# Altium project UZ_CarrierBoard.PrjPcb (part 3 of 10)

## Sheet Analog_Interface.SchDoc
size A4; Author: AG / EA / MG; CompanyName: Technische Hochschule Nürnberg Georg Simon Ohm; Organization: UltraZohm; Address1: Kesslerplatz 12; Address2: 90489 Nürnberg; Address3: GERMANY; SheetNumber: 17; Website: www.ultrazohm.com
Used 3 times, as channels U_Signal_Distribution/ANL1, U_Signal_Distribution/ANL2, U_Signal_Distribution/ANL3. Parts and nets are listed once, with the designators drawn on the sheet.
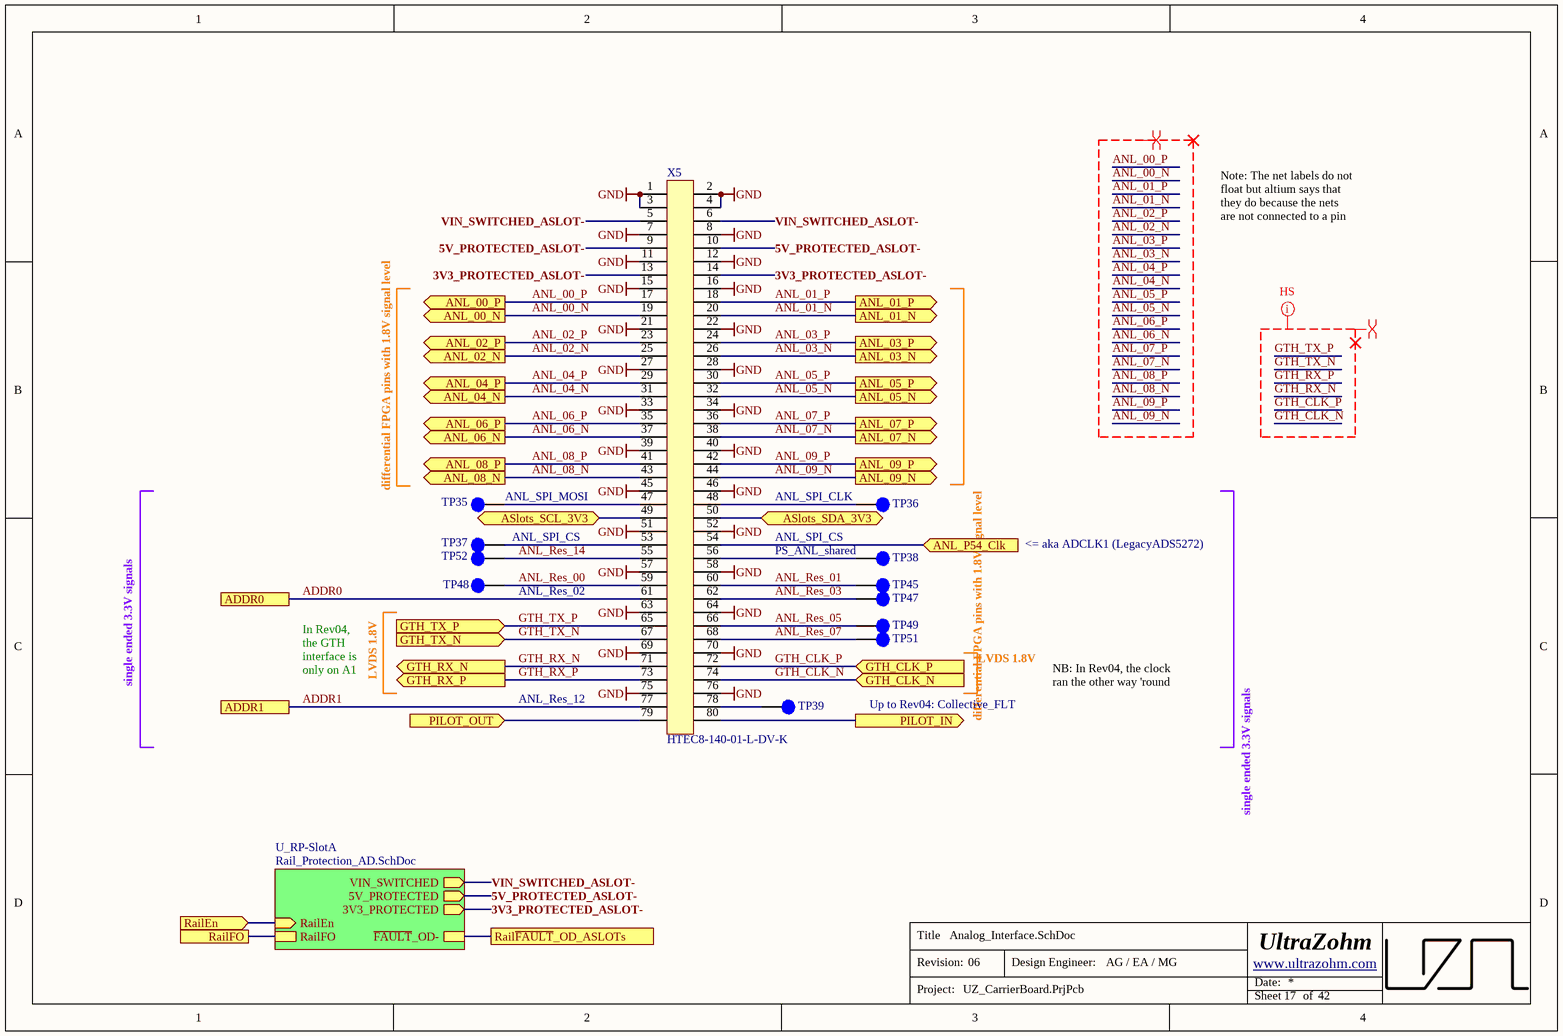
[diagram p4: Analog_Interface.SchDoc]

### Parts
TP35  Testpoint 1mm  [TP_1mm]  (value not drawn)  (no BOM)
TP36  Testpoint 1mm  [TP_1mm]  (value not drawn)  (no BOM)
TP37  Testpoint 1mm  [TP_1mm]  (value not drawn)  (no BOM)
TP38  Testpoint 1mm  [TP_1mm]  (value not drawn)  (no BOM)
TP39  Testpoint 1mm  [TP_1mm]  (value not drawn)  (no BOM)
TP45  Testpoint 1mm  [TP_1mm]  (value not drawn)  (no BOM)
TP47  Testpoint 1mm  [TP_1mm]  (value not drawn)  (no BOM)
TP48  Testpoint 1mm  [TP_1mm]  (value not drawn)  (no BOM)
TP49  Testpoint 1mm  [TP_1mm]  (value not drawn)  (no BOM)
TP51  Testpoint 1mm  [TP_1mm]  (value not drawn)  (no BOM)
TP52  Testpoint 1mm  [TP_1mm]  (value not drawn)  (no BOM)
X5  HTEC8-140-01-L-DV-K  [HTEC8-140-XX-X-DV]

### Sub-sheets
U_RP-SlotA = Rail_Protection_AD.SchDoc: RailEn (in), VIN_SWITCHED (out), ~{FAULT}_OD-, 5V_PROTECTED (out), 3V3_PROTECTED (out), RailFO

### Ports
ADDR0, ADDR1, ANL_00_N (out), ANL_00_P (out), ANL_01_N (out), ANL_01_P (out), ANL_02_N (out), ANL_02_P (out), ANL_03_N (out), ANL_03_P (out), ANL_04_N (out), ANL_04_P (out), ANL_05_N (out), ANL_05_P (out), ANL_06_N (out), ANL_06_P (out), ANL_07_N (out), ANL_07_P (out), ANL_08_N (out), ANL_08_P (out), ANL_09_N (out), ANL_09_P (out), ANL_P54_Clk (in), ASlots_SCL_3V3 (bidir), ASlots_SDA_3V3 (bidir), GTH_CLK_N (in), GTH_CLK_P (in), GTH_RX_N (out), GTH_RX_P (out), GTH_TX_N (in), GTH_TX_P (in), PILOT_IN (out), PILOT_OUT (in), RailEn (in), RailFO, Rail~{FAULT}_OD_ASLOTs

### Nets
GND: X5.1 X5.2 X5.3 X5.4 X5.7 X5.8 X5.11 X5.12 X5.15 X5.16 X5.21 X5.22 X5.27 X5.28 X5.33 X5.34 X5.39 X5.40 X5.45 X5.46 X5.51 X5.52 X5.57 X5.58 X5.63 X5.64 X5.69 X5.70 X5.75 X5.76
3V3_PROTECTED_ASLOT-: X5.13 X5.14 ; sheet U_RP-SlotA/3V3_PROTECTED
5V_PROTECTED_ASLOT-: X5.9 X5.10 ; sheet U_RP-SlotA/5V_PROTECTED
ADDR0: X5.61 ; port ADDR0
ADDR1: X5.77 ; port ADDR1
ANL_00_N: X5.19 ; port ANL_00_N
ANL_00_P: X5.17 ; port ANL_00_P
ANL_01_N: X5.20 ; port ANL_01_N
ANL_01_P: X5.18 ; port ANL_01_P
ANL_02_N: X5.25 ; port ANL_02_N
ANL_02_P: X5.23 ; port ANL_02_P
ANL_03_N: X5.26 ; port ANL_03_N
ANL_03_P: X5.24 ; port ANL_03_P
ANL_04_N: X5.31 ; port ANL_04_N
ANL_04_P: X5.29 ; port ANL_04_P
ANL_05_N: X5.32 ; port ANL_05_N
ANL_05_P: X5.30 ; port ANL_05_P
ANL_06_N: X5.37 ; port ANL_06_N
ANL_06_P: X5.35 ; port ANL_06_P
ANL_07_N: X5.38 ; port ANL_07_N
ANL_07_P: X5.36 ; port ANL_07_P
ANL_08_N: X5.43 ; port ANL_08_N
ANL_08_P: X5.41 ; port ANL_08_P
ANL_09_N: X5.44 ; port ANL_09_N
ANL_09_P: X5.42 ; port ANL_09_P
ANL_P54_Clk: X5.54 ; port ANL_P54_Clk
ANL_Res_00: TP48.1 X5.59
ANL_Res_01: TP45.1 X5.60
ANL_Res_03: TP47.1 X5.62
ANL_Res_05: TP49.1 X5.66
ANL_Res_07: TP51.1 X5.68
ANL_Res_14: TP52.1 X5.55
ASlots_SCL_3V3: X5.49 ; port ASlots_SCL_3V3
ASlots_SDA_3V3: X5.50 ; port ASlots_SDA_3V3
GTH_CLK_N: X5.74 ; port GTH_CLK_N
GTH_CLK_P: X5.72 ; port GTH_CLK_P
GTH_RX_N: X5.71 ; port GTH_RX_N
GTH_RX_P: X5.73 ; port GTH_RX_P
GTH_TX_N: X5.67 ; port GTH_TX_N
GTH_TX_P: X5.65 ; port GTH_TX_P
PILOT_IN: X5.80 ; port PILOT_IN
PILOT_OUT: X5.79 ; port PILOT_OUT
RailEn: port RailEn, sheet U_RP-SlotA/RailEn
Rail~{FAULT}_OD_ASLOTs: port Rail~{FAULT}_OD_ASLOTs, sheet U_RP-SlotA/~{FAULT}_OD-
RailFO: port RailFO, sheet U_RP-SlotA/RailFO
VIN_SWITCHED_ASLOT-: X5.5 X5.6 ; sheet U_RP-SlotA/VIN_SWITCHED
NetTP35_1: TP35.1 X5.47
NetTP36_1: TP36.1 X5.48
NetTP37_1: TP37.1 X5.53
NetTP38_1: TP38.1 X5.56
NetTP39_1: TP39.1 X5.78

### Channels
U_Signal_Distribution/ANL1: designators end in A; ports ADDR0=ADDR0 ADDR1=ADDR1 ANL_00_N=ANL_00_N ANL_00_P=ANL_00_P ANL_01_N=ANL_01_N ANL_01_P=ANL_01_P ANL_02_N=ANL_02_N ANL_02_P=ANL_02_P ANL_03_N=ANL_03_N ANL_03_P=ANL_03_P ANL_04_N=ANL_04_N ANL_04_P=ANL_04_P ANL_05_N=ANL_05_N ANL_05_P=ANL_05_P ANL_06_N=ANL_06_N ANL_06_P=ANL_06_P ANL_07_N=ANL_07_N ANL_07_P=ANL_07_P ANL_08_N=ANL_08_N ANL_08_P=ANL_08_P ANL_09_N=ANL_09_N ANL_09_P=ANL_09_P ANL_P54_Clk=ANL_P54_Clk1 ASlots_SCL_3V3=ASlots_SCL_3V3 ASlots_SDA_3V3=ASlots_SDA_3V3 GTH_CLK_N=GTH_CLK_N GTH_CLK_P=GTH_CLK_P GTH_RX_N=GTH_RX_N GTH_RX_P=GTH_RX_P GTH_TX_N=GTH_TX_N GTH_TX_P=GTH_TX_P PILOT_IN=ANL_S3C.SlotOK1 PILOT_OUT=ANL_S3C.CarrierReady RailEn=RailEn RailFO=RailFO_A1 Rail~{FAULT}_OD_ASLOTs=~{FAULT}_OD-
U_Signal_Distribution/ANL2: designators end in B; ports ADDR0=ADDR0_ANL2 ADDR1=ADDR1 ANL_00_N=ANL_00_N ANL_00_P=ANL_00_P ANL_01_N=ANL_01_N ANL_01_P=ANL_01_P ANL_02_N=ANL_02_N ANL_02_P=ANL_02_P ANL_03_N=ANL_03_N ANL_03_P=ANL_03_P ANL_04_N=ANL_04_N ANL_04_P=ANL_04_P ANL_05_N=ANL_05_N ANL_05_P=ANL_05_P ANL_06_N=ANL_06_N ANL_06_P=ANL_06_P ANL_07_N=ANL_07_N ANL_07_P=ANL_07_P ANL_08_N=ANL_08_N ANL_08_P=ANL_08_P ANL_09_N=ANL_09_N ANL_09_P=ANL_09_P ANL_P54_Clk=ANL_P54_Clk2 ASlots_SCL_3V3=ASlots_SCL_3V3 ASlots_SDA_3V3=ASlots_SDA_3V3 GTH_CLK_N=GTH_CLK_N GTH_CLK_P=GTH_CLK_P GTH_RX_N=GTH_RX_N GTH_RX_P=GTH_RX_P GTH_TX_N=GTH_TX_N GTH_TX_P=GTH_TX_P PILOT_IN=ANL_S3C.SlotOK2 PILOT_OUT=ANL_S3C.CarrierReady RailEn=RailEn RailFO=RailFO_A2 Rail~{FAULT}_OD_ASLOTs=~{FAULT}_OD-
U_Signal_Distribution/ANL3: designators end in C; ports ADDR0=ADDR0 ADDR1=ADDR1_ANL3 ANL_00_N=ANL_00_N ANL_00_P=ANL_00_P ANL_01_N=ANL_01_N ANL_01_P=ANL_01_P ANL_02_N=ANL_02_N ANL_02_P=ANL_02_P ANL_03_N=ANL_03_N ANL_03_P=ANL_03_P ANL_04_N=ANL_04_N ANL_04_P=ANL_04_P ANL_05_N=ANL_05_N ANL_05_P=ANL_05_P ANL_06_N=ANL_06_N ANL_06_P=ANL_06_P ANL_07_N=ANL_07_N ANL_07_P=ANL_07_P ANL_08_N=ANL_08_N ANL_08_P=ANL_08_P ANL_09_N=ANL_09_N ANL_09_P=ANL_09_P ANL_P54_Clk=ANL_P54_Clk3 ASlots_SCL_3V3=ASlots_SCL_3V3 ASlots_SDA_3V3=ASlots_SDA_3V3 GTH_CLK_N=GTH_CLK_N GTH_CLK_P=GTH_CLK_P GTH_RX_N=GTH_RX_N GTH_RX_P=GTH_RX_P GTH_TX_N=GTH_TX_N GTH_TX_P=GTH_TX_P PILOT_IN=ANL_S3C.SlotOK3 PILOT_OUT=ANL_S3C.CarrierReady RailEn=RailEn RailFO=RailFO_A3 Rail~{FAULT}_OD_ASLOTs=~{FAULT}_OD-

### Layout directives
differential pair: ANL_00_N, ANL_00_P, ANL_01_N, ANL_01_P, ANL_02_N, ANL_02_P, ANL_03_N, ANL_03_P, ANL_04_N, ANL_04_P, ANL_05_N, ANL_05_P, ANL_06_N, ANL_06_P, ANL_07_N, ANL_07_P, ANL_08_N, ANL_08_P, ANL_09_N, ANL_09_P, GTH_CLK_N, GTH_CLK_P, GTH_RX_N, GTH_RX_P, GTH_TX_N, GTH_TX_P
net class HS: GTH_CLK_N, GTH_CLK_P, GTH_RX_N, GTH_RX_P, GTH_TX_N, GTH_TX_P

### Notes on the sheet
- Note: The net labels do not float but altium says that they do because the nets are not connected to a pin
- differential FPGA pins with 1.8V signal level
- (near TP35) ANL_SPI_MOSI
- (near TP36) ANL_SPI_CLK
- ANL_SPI_CS
- PS_ANL_shared
- <= aka ADCLK1 (LegacyADS5272)
- ANL_Res_02
- single ended 3.3V signals
- In Rev04, the GTH interface is only on A1
- LVDS 1.8V
- ANL_Res_12
- Up to Rev04: Collective_FLT
- NB: In Rev04, the clock ran the other way 'round
- Title
- Revision:
- Design Engineer:
- Date:
- Project:
- Sheet
- of

### Library data of the parts
TP35-TP39 = NULL: Manufacturer Part Number: NULL; Created from: AGeiger; Created: 2018_06_25_AGeiger; Value: Testpoint 1mm; PartID: 9; Created On: 20/09/2022 13:14:57; Component Type: Testpoint; Last Updated: 20/09/2022 13:15:39; Manufacturer: NULL; Supplier 1: NULL; Supplier Part Number 1: NULL; Type: Testpoint; Live Cycle Status: 1
TP45 TP47-TP49 TP51 TP52 = 25063: AN: 25063; Mixed: SMT
X5 = HTEC8-140-01-L-DV-K: Headers & Wire Housings 0.80 mm Rugged High-Speed Edge Card Connectors; Manufacturer: SAMTEC; Created from: AGeiger; Number of positions: 80; Manufacturer Part Number: HTEC8-140-01-L-DV-K; PartID: 23; Created On: 07/06/2024 14:27:34; ComponentLink1Description: Datasheet; ComponentLink1URL: https://suddendocs.samtec.com/catalog_english/htec8.pdf; Component Type: Board to Board Connector; Device Package: SMD; Last Updated: 09/07/2024 10:19:13; Mounting Type: SMD; Series: HTEC8; Supplier 1: SAMTEC; Supplier Part Number 1: HTEC8-140-01-L-DV-K; Type: Board to Board Connector; Live Cycle Status: 1; Stock number: not stored; Number of rows: 2; LCSC Part Number: C20365608

## Sheet GTH.SchDoc
size A4; Author: AG / EA / MG; CompanyName: Technische Hochschule Nürnberg Georg Simon Ohm; Organization: UltraZohm; Address1: Kesslerplatz 12; Address2: 90489 Nürnberg; Address3: GERMANY; SheetNumber: 18; Website: www.ultrazohm.com
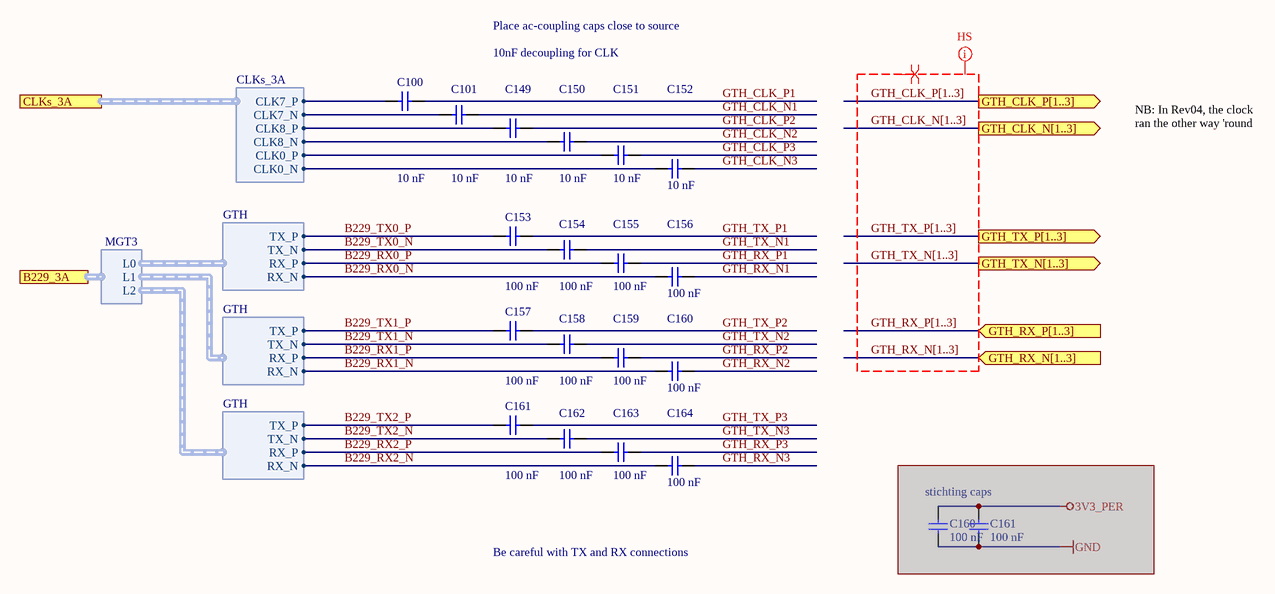
[diagram p5: GTH.SchDoc]

### Parts
(Parts that share a designator on the sheet are numbered #1, #2 ... from top to bottom, then left to right.)
C100  10 nF  [C_0402_TE]
C101  10 nF  [C_0402_TE]
C149  10 nF  [C_0402_TE]
C150  10 nF  [C_0402_TE]
C151  10 nF  [C_0402_TE]
C152  10 nF  [C_0402_TE]
C153  100 nF  [C_0402_TE]
C154  100 nF  [C_0402_TE]
C155  100 nF  [C_0402_TE]
C156  100 nF  [C_0402_TE]
C157  100 nF  [C_0402_TE]
C158  100 nF  [C_0402_TE]
C159  100 nF  [C_0402_TE]
C160#1  100 nF  [C_0402_TE]
C160#2  100 nF  [C_0402_TE]  (masked out: inside a compile mask, not in the netlist)
C161#1  100 nF  [C_0402_TE]
C161#2  100 nF  [C_0402_TE]  (masked out: inside a compile mask, not in the netlist)
C162  100 nF  [C_0402_TE]
C163  100 nF  [C_0402_TE]
C164  100 nF  [C_0402_TE]

### Ports
B229_3A (harness MGT3), CLKs_3A (harness CLKs_3A), GTH_CLK_N[1..3] (out), GTH_CLK_P[1..3] (out), GTH_RX_N[1..3] (in), GTH_RX_P[1..3] (in), GTH_TX_N[1..3] (out), GTH_TX_P[1..3] (out)

### Harnesses
GTH: RX_N, RX_P, TX_N, TX_P
MGT3: L0, L1, L2
CLKs_3A: CLK7_P, CLK7_N, CLK8_P, CLK8_N, CLK0_N, CLK0_P

### Nets
B229_RX0_N: C156.1 ; harness GTH.RX_N
B229_RX0_P: C155.1 ; harness GTH.RX_P
B229_RX1_N: C160#1.1 ; harness GTH.RX_N
B229_RX1_P: C159.1 ; harness GTH.RX_P
B229_RX2_N: C164.1 ; harness GTH.RX_N
B229_RX2_P: C163.1 ; harness GTH.RX_P
B229_TX0_N: C154.1 ; harness GTH.TX_N
B229_TX0_P: C153.1 ; harness GTH.TX_P
B229_TX1_N: C158.1 ; harness GTH.TX_N
B229_TX1_P: C157.1 ; harness GTH.TX_P
B229_TX2_N: C162.1 ; harness GTH.TX_N
B229_TX2_P: C161#1.1 ; harness GTH.TX_P
CLK0_N: C152.1 ; port CLKs_3A.CLK0_N
CLK0_P: C151.1 ; port CLKs_3A.CLK0_P
CLK7_N: C101.1 ; port CLKs_3A.CLK7_N
CLK7_P: C100.1 ; port CLKs_3A.CLK7_P
CLK8_N: C150.1 ; port CLKs_3A.CLK8_N
CLK8_P: C149.1 ; port CLKs_3A.CLK8_P
GTH_CLK_N1: C101.2  [project net GTH_CLK_N]
GTH_CLK_N2: C150.2  [project net GTH_CLK_N]
GTH_CLK_N3: C152.2  [project net GTH_CLK_N]
GTH_CLK_P1: C100.2  [project net GTH_CLK_P]
GTH_CLK_P2: C149.2  [project net GTH_CLK_P]
GTH_CLK_P3: C151.2  [project net GTH_CLK_P]
GTH_RX_N1: C156.2  [project net GTH_RX_N]
GTH_RX_N2: C160#1.2  [project net GTH_RX_N]
GTH_RX_N3: C164.2  [project net GTH_RX_N]
GTH_RX_P1: C155.2  [project net GTH_RX_P]
GTH_RX_P2: C159.2  [project net GTH_RX_P]
GTH_RX_P3: C163.2  [project net GTH_RX_P]
GTH_TX_N1: C154.2  [project net GTH_TX_N]
GTH_TX_N2: C158.2  [project net GTH_TX_N]
GTH_TX_N3: C162.2  [project net GTH_TX_N]
GTH_TX_P1: C153.2  [project net GTH_TX_P]
GTH_TX_P2: C157.2  [project net GTH_TX_P]
GTH_TX_P3: C161#1.2  [project net GTH_TX_P]

### Buses and harness runs
bus GTH_CLK_N[1..3] = port GTH_CLK_N[1..3]
bus GTH_CLK_P[1..3] = port GTH_CLK_P[1..3]
bus GTH_RX_N[1..3] = port GTH_RX_N[1..3]
bus GTH_RX_P[1..3] = port GTH_RX_P[1..3]
bus GTH_TX_N[1..3] = port GTH_TX_N[1..3]
bus GTH_TX_P[1..3] = port GTH_TX_P[1..3]

### Layout directives
differential pair: GTH_CLK_N[1..3], GTH_CLK_P[1..3], GTH_RX_N[1..3], GTH_RX_P[1..3], GTH_TX_N[1..3], GTH_TX_P[1..3]
net class HS: GTH_CLK_N[1..3], GTH_CLK_P[1..3], GTH_RX_N[1..3], GTH_RX_P[1..3], GTH_TX_N[1..3], GTH_TX_P[1..3]

### Notes on the sheet
- Place ac-coupling caps close to source
- 10nF decoupling for CLK
- NB: In Rev04, the clock ran the other way 'round
- stichting caps
- Be careful with TX and RX connections
- Title
- Revision:
- Design Engineer:
- Date:
- Project:
- Sheet
- of

### Library data of the parts
C100 C101 C149-C152 = UZgen_C_0402_10nF_16V_X7R: Generic capacitor; Manufacturer: UZgen; Voltage: 16V; Tolerance: 10 %; Created from: UZgenTool; Technology: X7R; Value: 10 nF; Manufacturer Part Number: UZgen_C_0402_10nF_16V_X7R; PartID: 2900; Created On: 02/08/2024 11:17:39; Device Package: 0402; Mounting Type: SMD; Last Updated: 02/08/2024 11:17:39
C153-C159 C160#1 C160#2 C161#1 C161#2 C162-C164 = UZgen_C_0402_100nF_50V_X7R: Generic capacitor; Manufacturer: UZgen; Voltage: 50V; Tolerance: 10 %; Created from: UZgenTool; Technology: X7R; Value: 100 nF; Manufacturer Part Number: UZgen_C_0402_100nF_50V_X7R; PartID: 3431; Created On: 02/08/2024 11:17:51; Device Package: 0402; Mounting Type: SMD; Last Updated: 02/08/2024 11:17:51

## Sheet DIG_S3C_MultiChannelFunnel.SchDoc
size A4; Organization: UltraZohm; SheetNumber: 22
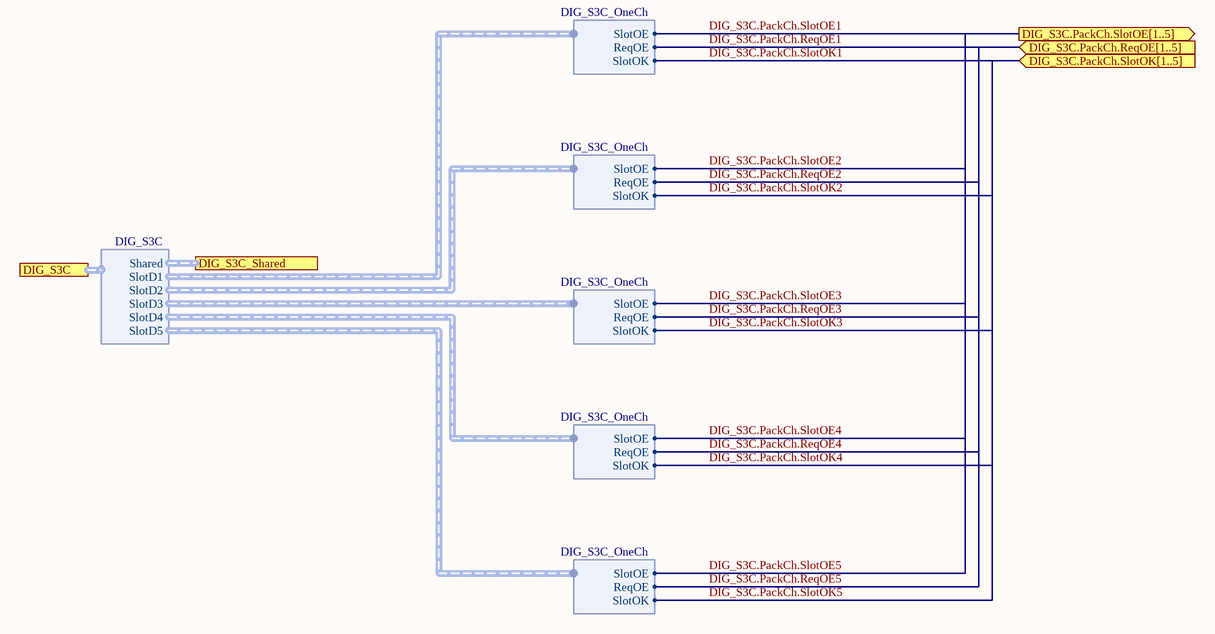
[diagram p6: DIG_S3C_MultiChannelFunnel.SchDoc]

### Ports
DIG_S3C (harness DIG_S3C), DIG_S3C.PackCh.ReqOE[1..5] (in), DIG_S3C.PackCh.SlotOE[1..5] (out), DIG_S3C.PackCh.SlotOK[1..5] (in), DIG_S3C_Shared (harness DIG_S3C_Shared)

### Harnesses
DIG_S3C: Shared, SlotD1, SlotD2, SlotD3, SlotD4, SlotD5
DIG_S3C_OneCh: SlotOE, ReqOE, SlotOK

### Nets
DIG_S3C.PackCh.ReqOE1: harness DIG_S3C_OneCh.ReqOE
DIG_S3C.PackCh.ReqOE2: harness DIG_S3C_OneCh.ReqOE
DIG_S3C.PackCh.ReqOE3: harness DIG_S3C_OneCh.ReqOE
DIG_S3C.PackCh.ReqOE4: harness DIG_S3C_OneCh.ReqOE
DIG_S3C.PackCh.ReqOE5: harness DIG_S3C_OneCh.ReqOE
DIG_S3C.PackCh.SlotOE1: harness DIG_S3C_OneCh.SlotOE
DIG_S3C.PackCh.SlotOE2: harness DIG_S3C_OneCh.SlotOE
DIG_S3C.PackCh.SlotOE3: harness DIG_S3C_OneCh.SlotOE
DIG_S3C.PackCh.SlotOE4: harness DIG_S3C_OneCh.SlotOE
DIG_S3C.PackCh.SlotOE5: harness DIG_S3C_OneCh.SlotOE
DIG_S3C.PackCh.SlotOK1: harness DIG_S3C_OneCh.SlotOK
DIG_S3C.PackCh.SlotOK2: harness DIG_S3C_OneCh.SlotOK
DIG_S3C.PackCh.SlotOK3: harness DIG_S3C_OneCh.SlotOK
DIG_S3C.PackCh.SlotOK4: harness DIG_S3C_OneCh.SlotOK
DIG_S3C.PackCh.SlotOK5: harness DIG_S3C_OneCh.SlotOK

### Notes on the sheet
- Title
- Revision:
- Design Engineer:
- Date:
- Project:
- Sheet
- of

## Sheet Rail_Shutdown_AD.SchDoc
size A4; SheetNumber: 20
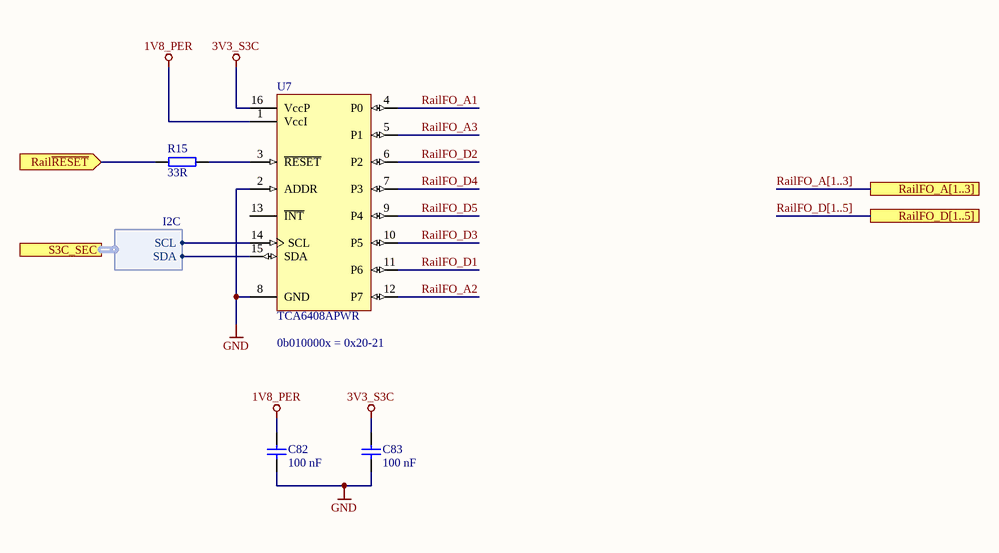
[diagram p7: Rail_Shutdown_AD.SchDoc]

### Parts
C82  100 nF  [C_0603_TE]
C83  100 nF  [C_0603_TE]
R15  33R  [R_0603_TE]
U7  TCA6408APWR  [TSSOP-16_PW0016A_N]

### Ports
RailFO_A[1..3], RailFO_D[1..5], Rail~{RESET} (in), S3C_SEC (harness I2C)

### Harnesses
I2C: SCL, SDA

### Nets
1V8_PER: C82.1 U7.1(VccI)
3V3_S3C: C83.1 U7.16(VccP)
GND: C82.2 C83.2 U7.2(ADDR) U7.8(GND)
Carrier_PG_1V8: R15.1 ; port Rail~{RESET}
RailFO_A1: U7.4(P0)
RailFO_A2: U7.12(P7)
RailFO_A3: U7.5(P1)
RailFO_D1: U7.11(P6)
RailFO_D2: U7.6(P2)
RailFO_D3: U7.10(P5)
RailFO_D4: U7.7(P3)
RailFO_D5: U7.9(P4)
NetR15_2: R15.2 U7.3(~{RESET})
NetR37_2: U7.14(SCL) ; port S3C_SEC.SCL
NetR38_2: U7.15(SDA) ; port S3C_SEC.SDA

Not connected (* = marked no-connect by the designer): U7 13(~{INT})

### Buses and harness runs
bus RailFO_A[1..3] = port RailFO_A[1..3]
bus RailFO_D[1..5] = port RailFO_D[1..5]

### Notes on the sheet
- (near U7) 0b010000x = 0x20-21
- Title
- Revision:
- Design Engineer:
- Date:
- Project:
- Sheet
- of

### Library data of the parts
C82 C83 = UZgen_C_0603_100nF_50V_X7R: Generic capacitor; Manufacturer: UZgen; Voltage: 50V; Tolerance: 10 %; Created from: AGeiger; Manufacturer Part Number: UZgen_C_0603_100nF_50V_X7R; PartID: 1; Created On: 02/07/2024 14:42:23; Value: 100 nF; Device Package: 0603; Technology: X7R; Mounting Type: SMD; Last Updated: 08/08/2024 15:01:15
R15 = UZgen_R_0603_33R: Generic resistor; Manufacturer: UZgen; Tolerance: 1 %; Created from: UZgenTool; Manufacturer Part Number: UZgen_R_0603_33R; PartID: 185; Created On: 02/07/2024 17:29:48; Value: 33R; Device Package: 0603; Mounting Type: SMD; Last Updated: 02/07/2024 17:29:48
U7 = TCA6408APWR: Low-Voltage 8-Bit I²C and SMBus I/O Expander With Interrupt Output, Reset, and Configuration Registers; Manufacturer: Texas Instruments; Created from: MGeier; Manufacturer Part Number: TCA6408APWR; PartID: 8; Created On: 17/07/2025 17:45:00; ComponentLink1Description: Datasheet; ComponentLink1URL: https://www.ti.com/lit/ds/symlink/tca6408a.pdf; Component Type: I²C-IO-Expander; Device Package: TSSOP-16; Last Updated: 17/07/2025 17:45:00; Mounting Type: SMD; Supplier 1: LCSC; Supplier Part Number 1: C206177; Type: I²C IO Expander; Live Cycle Status: 1; LCSC Part Number: C206177; Stock number: not stored

## Sheet ANL_P54_Buffer.SchDoc
size A4; SheetNumber: 19
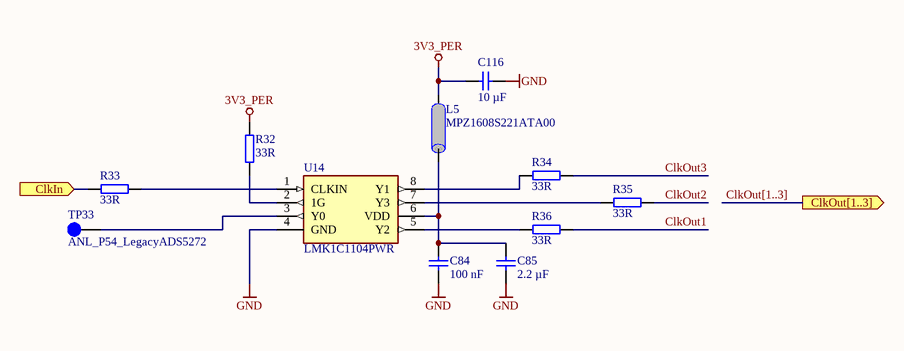
[diagram p8: ANL_P54_Buffer.SchDoc]

### Parts
C84  100 nF  [C_0603_TE]
C85  2.2 µF  [C_0603_TE]
C116  10 µF  [C_0603_TE]
L5  MPZ1608S221ATA00  [RES 0603_1608]
R32  33R  [R_0603_TE]
R33  33R  [R_0603_TE]
R34  33R  [R_0603_TE]
R35  33R  [R_0603_TE]
R36  33R  [R_0603_TE]
TP33  ANL_P54_LegacyADS5272  [TP_1mm]  (no BOM)
U14  LMK1C1104PWR  [TSSOP-8]

### Ports
ClkIn (in), ClkOut[1..3] (out)

### Nets
3V3_PER: C116.2 L5.1 R32.1
GND: C84.1 C85.1 C116.1 U14.4(GND)
ANL_S3C.P54_Legacy: R33.2 ; port ClkIn
ClkOut1: R36.1  [project net ANL_P54_Clk1]
ClkOut2: R35.1  [project net ANL_P54_Clk2]
ClkOut3: R34.1  [project net ANL_P54_Clk3]
NetC84_2: C84.2 C85.2 L5.2 U14.6(VDD)
NetR32_2: R32.2 U14.2(1G)
NetR33_1: R33.1 U14.1(CLKIN)
NetR34_2: R34.2 U14.8(Y1)
NetR35_2: R35.2 U14.7(Y3)
NetR36_2: R36.2 U14.5(Y2)
NetTP33_1: TP33.1 U14.3(Y0)

### Buses and harness runs
bus ClkOut[1..3] = port ClkOut[1..3]

### Notes on the sheet
- Title
- Revision:
- Design Engineer:
- Date:
- Project:
- Sheet
- of

### Library data of the parts
C84 = UZgen_C_0603_100nF_50V_X7R: as C82 on sheet Rail_Shutdown_AD; Manufacturer Part Number: UZgen_C_0603_100nF_50V_X7R; PartID: 1; Created On: 02/07/2024 14:42:23; Value: 100 nF; Device Package: 0603; Technology: X7R; Mounting Type: SMD; Last Updated: 08/08/2024 15:01:15
C85 = UZgen_C_0603_2.2uF_50V_X7R: Generic capacitor; Manufacturer: UZgen; Voltage: 50V; Tolerance: 10 %; Created from: UZgenTool; Manufacturer Part Number: UZgen_C_0603_2.2uF_50V_X7R; PartID: 4317; Created On: 02/08/2024 11:18:10; Value: 2.2 µF; Device Package: 0603; Technology: X7R; Mounting Type: SMD; Last Updated: 02/08/2024 11:18:10
C116 = UZgen_C_0603_10uF_6.3V_X7R: Generic capacitor; Manufacturer: UZgen; Voltage: 6.3V; Tolerance: 10 %; Created from: UZgenTool; Manufacturer Part Number: UZgen_C_0603_10uF_6.3V_X7R; PartID: 3631; Created On: 02/08/2024 11:17:55; Value: 10 µF; Device Package: 0603; Technology: X7R; Mounting Type: SMD; Last Updated: 02/08/2024 11:17:55
L5 = MPZ1608S221ATA00: Ferritperle, 0603, 220 ohm, 2.2 A, Baureihe MPZ, 0.05 ohm, ± 25%; Manufacturer: TDK; Type: Ferrite; DC current: 2.2 A; Value: 220 Ohm; Created from: MGremer; Manufacturer Part Number: MPZ1608S221ATA00; PartID: 3; Created On: 08/06/2021 11:33:39; ComponentLink1Description: Datasheet; ComponentLink1URL: http://www.farnell.com/datasheets/2291439.pdf; Component Type: Ferritperle; Device Package: 0603; Last Updated: 12/07/2024 17:26:54; Mounting Type: SMD; Operating Temperature: -55 - 125 °C; Series: MPZ; Supplier 1: Farnell; Supplier Part Number 1: 1301677RL; Live Cycle Status: 1; LCSC Part Number: C76815; Stock number: not stored
R32-R36 = UZgen_R_0603_33R: as R15 on sheet Rail_Shutdown_AD; Manufacturer Part Number: UZgen_R_0603_33R; PartID: 185; Created On: 02/07/2024 17:29:48; Value: 33R; Device Package: 0603; Mounting Type: SMD; Last Updated: 02/07/2024 17:29:48
TP33 = NULL: Testpoint 1mm; Manufacturer Part Number: NULL; Created from: AGeiger; Created: 2018_06_25_AGeiger; Value: ANL_P54_LegacyADS5272; PartID: 9; Created On: 20/09/2022 13:14:57; Component Type: Testpoint; Last Updated: 20/09/2022 13:15:39; Manufacturer: NULL; Supplier 1: NULL; Supplier Part Number 1: NULL; Type: Testpoint; Live Cycle Status: 1
U14 = LMK1C1104PWR: 250MHz TSSOP-8 Clock Buffers, Drivers ROHS; Manufacturer: Texas Instruments; Created from: FRosner; Manufacturer Part Number: LMK1C1104PWR; PartID: 6; Created On: 18/06/2025 09:32:31; ComponentLink1Description: Datasheet; ComponentLink1URL: https://www.ti.com/cn/lit/ds/symlink/lmk1c1104.pdf?ts=1750149306598&ref_url=https%253A%252F%252Flist.szlcsc.com%252F; Component Type: Clock Buffer; Device Package: TSSOP-8; Last Updated: 18/06/2025 09:32:31; Mounting Type: SMD; Operating Temperature: -40 to +125°C; Supplier 1: LCSC; Supplier Part Number 1: C1855734; Value: 250MHz; LCSC Part Number: C1855734

## Sheet SoM.SchDoc
size A4; Author: AG / EA / MG; CompanyName: Technische Hochschule Nürnberg Georg Simon Ohm; Organization: UltraZohm; Address1: Kesslerplatz 12; Address2: 90489 Nürnberg; Address3: GERMANY; SheetNumber: 2; Website: www.ultrazohm.com
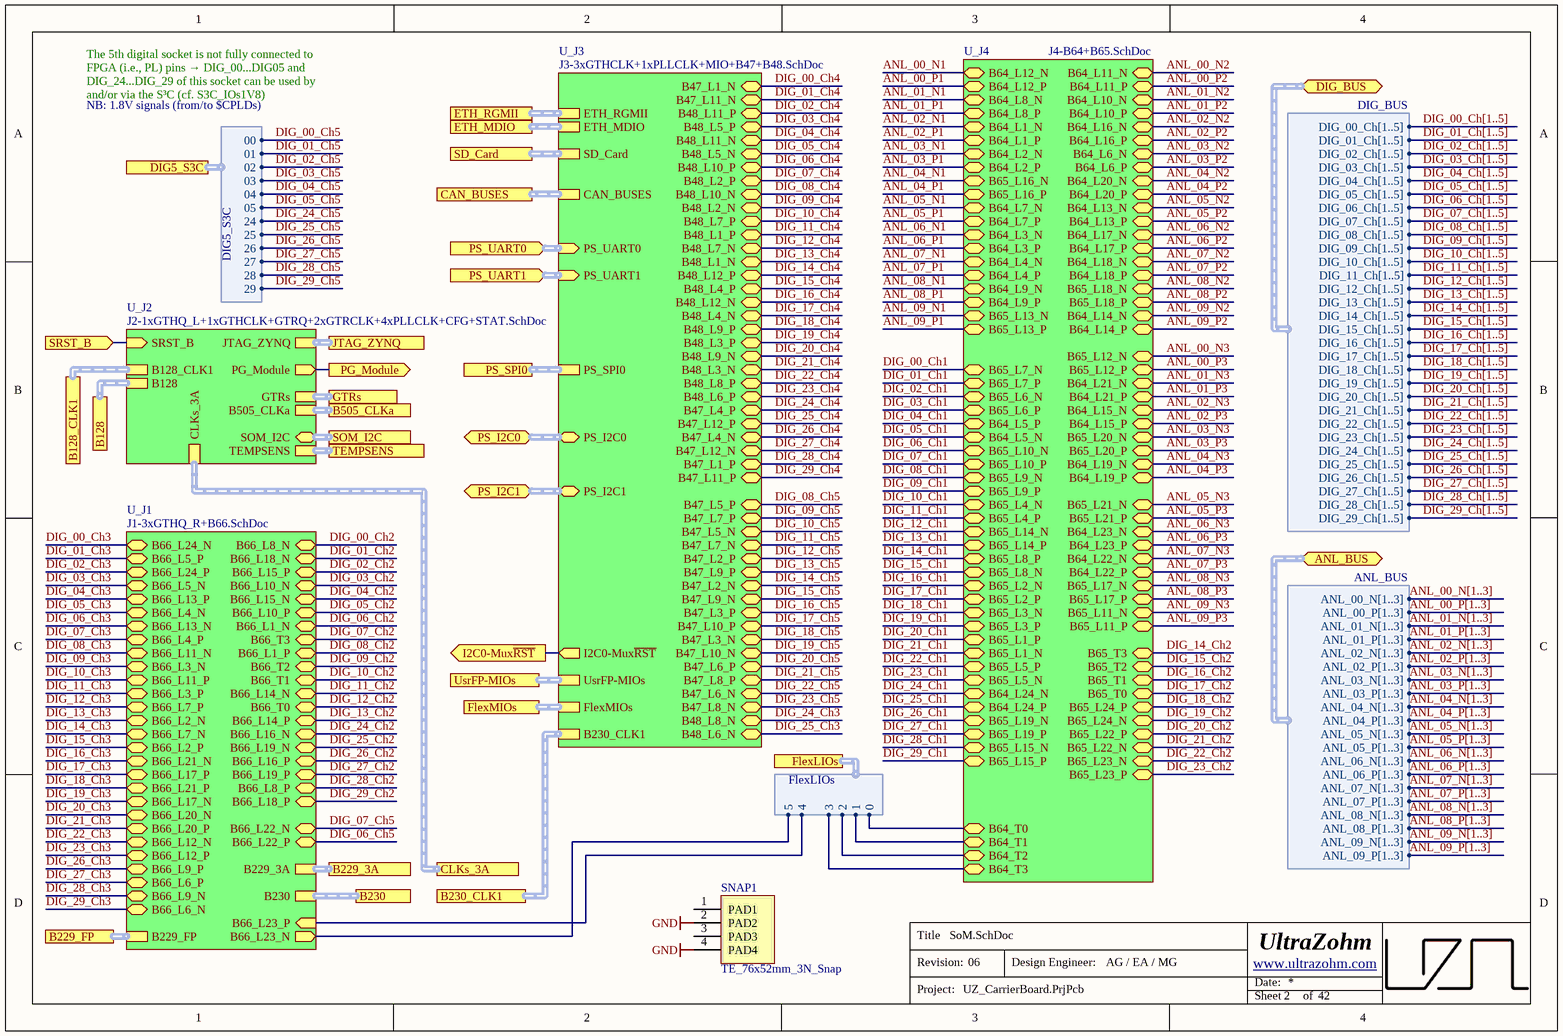
[diagram p9: SoM.SchDoc]

### Parts
SNAP1  TE_76x52mm_3N_Snap  [TE_76x52mm_Snap]  (no BOM)

### Sub-sheets
U_J1 = J1-3xGTHQ_R+B66.SchDoc: B66_L1_P (bidir), B66_L1_N (bidir), B66_L5_P (bidir), B66_L5_N (bidir), B66_L6_P (bidir), B66_L6_N (bidir), B66_L4_N (bidir), B66_L4_P (bidir), B66_L2_N (bidir), B66_L24_N (bidir), B66_L9_N (bidir), B66_L8_N (bidir), B66_L23_N (out), B66_L20_N (bidir), B66_L12_N (bidir), B66_L24_P (bidir), B66_L8_P (bidir), B66_L18_N (bidir), B66_L21_N (bidir), B66_L7_P (bidir), B66_L19_P (bidir), B66_L11_N (bidir), B66_L20_P (bidir), B66_L21_P (bidir), B66_L9_P (bidir), B66_L10_P (bidir), B66_L22_P (bidir), B66_L16_N (bidir), B66_L3_P (bidir), B66_L17_N (bidir), B66_L15_P (bidir), B66_L16_P (bidir), B66_L19_N (bidir), B66_L14_N (bidir), B66_L17_P (bidir), B66_L7_N (bidir), B66_L3_N (bidir), B66_L10_N (bidir), B66_L15_N (bidir), B66_L22_N (bidir), B66_L14_P (bidir), B66_L11_P (bidir), B66_L2_P (bidir), B66_L13_P (bidir), B66_L23_P (in), B66_L18_P (bidir), B66_L12_P (bidir), B66_L13_N (bidir), B66_T1 (bidir), B66_T2 (bidir), B66_T0 (bidir), B66_T3 (bidir), B229_3A (harness MGT3), B230 (harness MGT4), B229_FP (harness GTH)
U_J2 = J2-1xGTHQ_L+1xGTHCLK+GTRQ+2xGTRCLK+4xPLLCLK+CFG+STAT.SchDoc: SRST_B (in), PG_Module (out), SOM_I2C (bidir, harness I2C), GTRs (harness GTRs), JTAG_ZYNQ (harness JTAG), TEMPSENS (harness T_DIODE), B505_CLKa (harness MGTCLK), CLKs_3A (harness CLKs_3A), B128 (harness MGT4), B128_CLK1 (harness MGTCLK)
U_J3 = J3-3xGTHCLK+1xPLLCLK+MIO+B47+B48.SchDoc: B48_L9_P (bidir), B47_L6_P (bidir), B48_L2_P (bidir), B48_L8_N (bidir), B48_L1_P (bidir), B47_L8_N (bidir), B47_L10_P (bidir), B47_L12_P (bidir), B47_L8_P (bidir), B47_L9_P (bidir), B48_L12_P (bidir), B48_L2_N (bidir), B47_L4_P (bidir), B47_L2_P (bidir), B47_L10_N (bidir), B48_L12_N (bidir), B47_L2_N (bidir), B47_L3_N (bidir), B48_L6_N (bidir), B48_L3_P (bidir), B47_L3_P (bidir), B47_L7_N (bidir), B48_L11_N (bidir), B48_L4_P (bidir), B47_L5_P (bidir), B47_L1_N (bidir), B47_L1_P (bidir), B47_L6_N (bidir), B48_L5_P (bidir), B48_L10_P (bidir), B47_L5_N (bidir), B48_L3_N (bidir), B47_L7_P (bidir), B48_L1_N (bidir), B48_L5_N (bidir), B47_L12_N (bidir), B48_L9_N (bidir), B48_L11_P (bidir), B47_L9_N (bidir), B48_L4_N (bidir), B47_L4_N (bidir), B48_L6_P (bidir), B47_L11_P (bidir), B48_L8_P (bidir), B48_L10_N (bidir), B47_L11_N (bidir), B48_L7_P (bidir), B48_L7_N (bidir), PS_UART0 (in, harness UART), PS_UART1 (in, harness UART), PS_I2C1 (bidir, harness I2C), PS_I2C0 (bidir, harness I2C), ETH_RGMII (harness ETH_RGMII), SD_Card (harness SD_Card), ETH_MDIO (harness ETH_MDIO), PS_SPI0 (harness SPI), CAN_BUSES (harness CAN_BUSES), UsrFP-MIOs (harness UsrFP-MIOs), FlexMIOs (harness FlexMIOs), I2C0-Mux~{RST} (out), B230_CLK1 (harness MGTCLK)
U_J4 = J4-B64+B65.SchDoc: B65_L1_N (bidir), B65_L1_P (bidir), B64_L9_N (bidir), B64_L5_P (bidir), B64_L9_P (bidir), B64_L4_P (bidir), B64_L7_N (bidir), B64_L2_N (bidir), B64_L4_N (bidir), B64_L12_N (bidir), B64_L1_P (bidir), B64_L12_P (bidir), B64_L10_N (bidir), B64_L8_N (bidir), B64_L6_P (bidir), B64_L7_P (bidir), B64_L5_N (bidir), B64_L3_P (bidir), B64_L6_N (bidir), B64_L3_N (bidir), B64_L1_N (bidir), B64_L2_P (bidir), B64_L11_N (bidir), B64_L10_P (bidir), B64_L8_P (bidir), B64_L11_P (bidir), B64_L21_P (bidir), B64_L19_P (bidir), B64_L16_N (bidir), B64_L13_P (bidir), B64_L14_P (bidir), B64_L17_N (bidir), B64_L18_N (bidir), B64_L16_P (bidir), B64_L20_P (bidir), B64_L24_P (bidir), B64_L15_P (bidir), B64_L13_N (bidir), B64_L14_N (bidir), B64_L23_P (bidir), B64_L24_N (bidir), B64_L15_N (bidir), B64_L19_N (bidir), B64_L17_P (bidir), B64_L22_P (bidir), B64_L20_N (bidir), B64_L22_N (bidir), B64_L23_N (bidir), B64_L18_P (bidir), B64_L21_N (bidir), B65_L5_P (bidir), B65_L9_P (bidir), B65_L10_P (bidir), B65_L8_P (bidir), B65_L10_N (bidir), B65_L2_N (bidir), B65_L11_P (bidir), B65_L6_N (bidir), B65_L11_N (bidir), B65_L4_P (bidir), B65_L8_N (bidir), B65_L5_N (bidir), B65_L7_N (bidir), B65_L7_P (bidir), B65_L12_P (bidir), B65_L3_P (bidir), B65_L12_N (bidir), B65_L3_N (bidir), B65_L4_N (bidir), B65_L2_P (bidir), B65_L6_P (bidir), B65_L9_N (bidir), B65_L16_P (bidir), B65_L23_N (bidir), B65_L13_N (bidir), B65_L13_P (bidir), B65_L16_N (bidir), B65_L24_P (bidir), B65_L21_P (bidir), B65_L15_N (bidir), B65_L17_N (bidir), B65_L18_P (bidir), B65_L20_N (bidir), B65_L19_P (bidir), B65_L21_N (bidir), B65_L15_P (bidir), B65_L22_N (bidir), B65_L23_P (bidir), B65_L17_P (bidir), B65_L22_P (bidir), B65_L24_N (bidir), B65_L19_N (bidir), B65_L18_N (bidir), B65_L20_P (bidir), B65_T1 (bidir), B65_T2 (bidir), B65_T3 (bidir), B65_T0 (bidir), B65_L14_N (bidir), B65_L14_P (bidir), B64_T0 (bidir), B64_T1 (bidir), B64_T2 (bidir), B64_T3 (bidir)

### Ports
ANL_BUS (bidir, harness ANL_BUS), B128 (harness MGT4), B128_CLK1 (harness MGTCLK), B229_3A (harness MGT3), B229_FP (harness GTH), B230 (harness MGT4), B230_CLK1 (harness MGTCLK), B505_CLKa (harness MGTCLK), CAN_BUSES (harness CAN_BUSES), CLKs_3A (harness CLKs_3A), DIG5_S3C (harness DIG5_S3C), DIG_BUS (bidir, harness DIG_BUS), ETH_MDIO (harness ETH_MDIO), ETH_RGMII (harness ETH_RGMII), FlexLIOs (harness FlexLIOs), FlexMIOs (harness FlexMIOs), GTRs (harness GTRs), I2C0-Mux~{RST} (out), JTAG_ZYNQ (harness JTAG), PG_Module (out), PS_I2C0 (bidir, harness I2C), PS_I2C1 (bidir, harness I2C), PS_SPI0 (harness SPI), PS_UART0 (in, harness UART), PS_UART1 (in, harness UART), SD_Card (harness SD_Card), SOM_I2C (harness I2C), SRST_B (in), TEMPSENS (harness T_DIODE), UsrFP-MIOs (harness UsrFP-MIOs)

### Harnesses
DIG_BUS: DIG_01_Ch[1..5], DIG_02_Ch[1..5], DIG_03_Ch[1..5], DIG_04_Ch[1..5], DIG_05_Ch[1..5], DIG_06_Ch[1..5], DIG_07_Ch[1..5], DIG_08_Ch[1..5], DIG_09_Ch[1..5], DIG_10_Ch[1..5], DIG_11_Ch[1..5], DIG_12_Ch[1..5], DIG_13_Ch[1..5], DIG_14_Ch[1..5], DIG_15_Ch[1..5], DIG_16_Ch[1..5], DIG_17_Ch[1..5], DIG_18_Ch[1..5], DIG_19_Ch[1..5], DIG_20_Ch[1..5], DIG_21_Ch[1..5], DIG_22_Ch[1..5], DIG_23_Ch[1..5], DIG_24_Ch[1..5], DIG_25_Ch[1..5], DIG_26_Ch[1..5], DIG_27_Ch[1..5], DIG_28_Ch[1..5], DIG_29_Ch[1..5], DIG_00_Ch[1..5]
ANL_BUS: ANL_00_N[1..3], ANL_00_P[1..3], ANL_01_N[1..3], ANL_01_P[1..3], ANL_02_N[1..3], ANL_02_P[1..3], ANL_03_N[1..3], ANL_03_P[1..3], ANL_04_N[1..3], ANL_04_P[1..3], ANL_05_N[1..3], ANL_05_P[1..3], ANL_06_N[1..3], ANL_06_P[1..3], ANL_07_N[1..3], ANL_07_P[1..3], ANL_08_N[1..3], ANL_08_P[1..3], ANL_09_N[1..3], ANL_09_P[1..3]
DIG5_S3C: 00, 01, 02, 03, 04, 05, 24, 25, 26, 27, 28, 29
FlexLIOs: 0, 1, 2, 3, 4, 5

### Nets
GND: SNAP1.2(PAD2) SNAP1.4(PAD4)
B64_T0: sheet U_J4/B64_T0, port FlexLIOs.0
B64_T1: sheet U_J4/B64_T1, port FlexLIOs.1
B64_T2: sheet U_J4/B64_T2, port FlexLIOs.2
B64_T3: sheet U_J4/B64_T3, port FlexLIOs.3
B66_L23_N: sheet U_J1/B66_L23_N, port FlexLIOs.5
B66_L23_P: sheet U_J1/B66_L23_P, port FlexLIOs.4
I2C0-Mux~{RST}: port I2C0-Mux~{RST}, sheet U_J3/I2C0-Mux~{RST}
PG_Module: port PG_Module, sheet U_J2/PG_Module
SRST_B: port SRST_B, sheet U_J2/SRST_B

Not connected (* = marked no-connect by the designer): SNAP1 1(PAD1) 3(PAD3)

### Buses and harness runs
bus ANL_00_N[1..3]
bus ANL_00_P[1..3]
bus ANL_01_N[1..3]
bus ANL_01_P[1..3]
bus ANL_02_N[1..3]
bus ANL_02_P[1..3]
bus ANL_03_N[1..3]
bus ANL_03_P[1..3]
bus ANL_04_N[1..3]
bus ANL_04_P[1..3]
bus ANL_05_N[1..3]
bus ANL_05_P[1..3]
bus ANL_06_N[1..3]
bus ANL_06_P[1..3]
bus ANL_07_N[1..3]
bus ANL_07_P[1..3]
bus ANL_08_N[1..3]
bus ANL_08_P[1..3]
bus ANL_09_N[1..3]
bus ANL_09_P[1..3]
bus DIG_00_Ch[1..5]
bus DIG_01_Ch[1..5]
bus DIG_02_Ch[1..5]
bus DIG_03_Ch[1..5]
bus DIG_04_Ch[1..5]
bus DIG_05_Ch[1..5]
bus DIG_06_Ch[1..5]
bus DIG_07_Ch[1..5]
bus DIG_08_Ch[1..5]
bus DIG_09_Ch[1..5]
bus DIG_10_Ch[1..5]
bus DIG_11_Ch[1..5]
bus DIG_12_Ch[1..5]
bus DIG_13_Ch[1..5]
bus DIG_14_Ch[1..5]
bus DIG_15_Ch[1..5]
bus DIG_16_Ch[1..5]
bus DIG_17_Ch[1..5]
bus DIG_18_Ch[1..5]
bus DIG_19_Ch[1..5]
bus DIG_20_Ch[1..5]
bus DIG_21_Ch[1..5]
bus DIG_22_Ch[1..5]
bus DIG_23_Ch[1..5]
bus DIG_24_Ch[1..5]
bus DIG_25_Ch[1..5]
bus DIG_26_Ch[1..5]
bus DIG_27_Ch[1..5]
bus DIG_28_Ch[1..5]
bus DIG_29_Ch[1..5]
harness port B128 = sheet U_J2/B128
harness port B128_CLK1 = sheet U_J2/B128_CLK1
harness port B229_3A = sheet U_J1/B229_3A
harness port B229_FP = sheet U_J1/B229_FP
harness port B230 = sheet U_J1/B230
harness port B230_CLK1 = sheet U_J3/B230_CLK1
harness port B505_CLKa = sheet U_J2/B505_CLKa
harness port CAN_BUSES = sheet U_J3/CAN_BUSES
harness port CLKs_3A = sheet U_J2/CLKs_3A
harness port ETH_MDIO = sheet U_J3/ETH_MDIO
harness port ETH_RGMII = sheet U_J3/ETH_RGMII
harness port FlexMIOs = sheet U_J3/FlexMIOs
harness port GTRs = sheet U_J2/GTRs
harness port JTAG_ZYNQ = sheet U_J2/JTAG_ZYNQ
harness port PS_I2C0 = sheet U_J3/PS_I2C0
harness port PS_I2C1 = sheet U_J3/PS_I2C1
harness port PS_SPI0 = sheet U_J3/PS_SPI0
harness port PS_UART0 = sheet U_J3/PS_UART0
harness port PS_UART1 = sheet U_J3/PS_UART1
harness port SD_Card = sheet U_J3/SD_Card
harness port SOM_I2C = sheet U_J2/SOM_I2C
harness port TEMPSENS = sheet U_J2/TEMPSENS
harness port UsrFP-MIOs = sheet U_J3/UsrFP-MIOs

### Notes on the sheet
- The 5th digital socket is not fully connected to FPGA (i.e., PL) pins → DIG_00...DIG05 and DIG_24...DIG_29 of this socket can be used by and/or via the S³C (cf. S3C_IOs1V8)
- NB: 1.8V signals (from/to $CPLDs)
- Title
- Revision:
- Design Engineer:
- Date:
- Project:
- Sheet
- of

### Library data of the parts
SNAP1 = 27115: TE0808 76x52mm Snap; AN: 27115; Mixed: SMT

## Sheet J1-3xGTHQ_R+B66.SchDoc
size A4; Author: AG / EA / MG; CompanyName: Technische Hochschule Nürnberg Georg Simon Ohm; Organization: UltraZohm; Address1: Kesslerplatz 12; Address2: 90489 Nürnberg; Address3: GERMANY; SheetNumber: 3; Website: www.ultrazohm.com
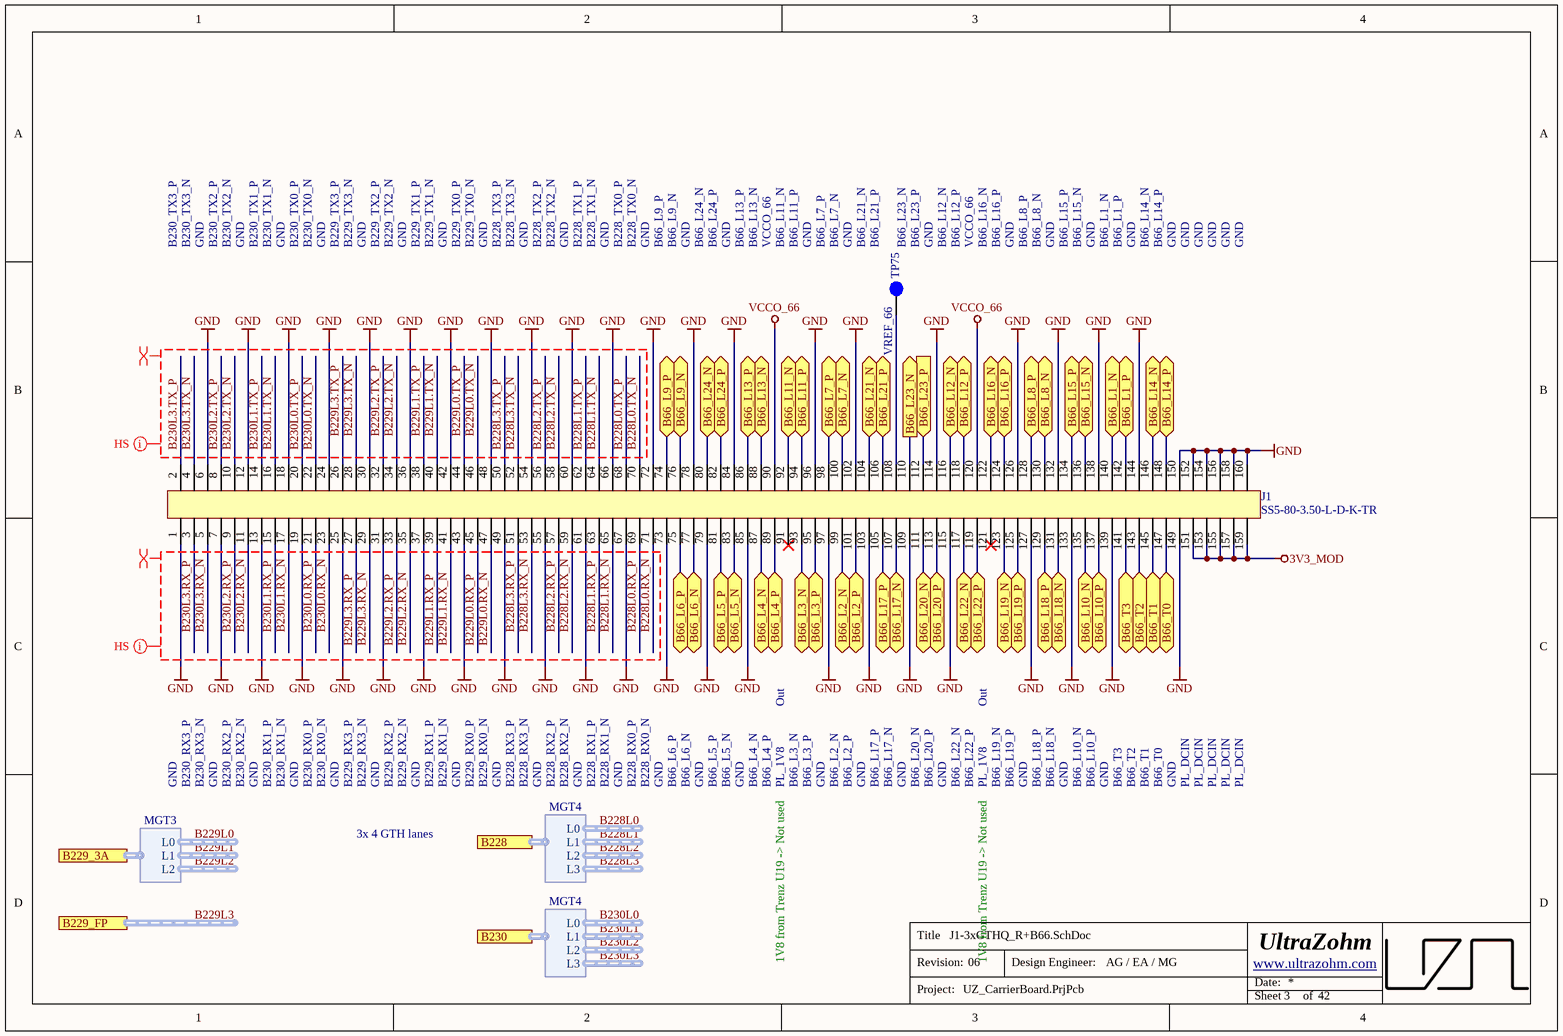
[diagram p10: J1-3xGTHQ_R+B66.SchDoc]

### Parts
J1  SS5-80-3.50-L-D-K-TR  [SS5-80-3.50-L-D-K-TR]
TP75  Testpoint 1mm  [TP_1mm]  (value not drawn)  (no BOM)

### Ports
B66_L1_N (bidir), B66_L1_P (bidir), B66_L2_N (bidir), B66_L2_P (bidir), B66_L3_N (bidir), B66_L3_P (bidir), B66_L4_N (bidir), B66_L4_P (bidir), B66_L5_N (bidir), B66_L5_P (bidir), B66_L6_N (bidir), B66_L6_P (bidir), B66_L7_N (bidir), B66_L7_P (bidir), B66_L8_N (bidir), B66_L8_P (bidir), B66_L9_N (bidir), B66_L9_P (bidir), B66_L10_N (bidir), B66_L10_P (bidir), B66_L11_N (bidir), B66_L11_P (bidir), B66_L12_N (bidir), B66_L12_P (bidir), B66_L13_N (bidir), B66_L13_P (bidir), B66_L14_N (bidir), B66_L14_P (bidir), B66_L15_N (bidir), B66_L15_P (bidir), B66_L16_N (bidir), B66_L16_P (bidir), B66_L17_N (bidir), B66_L17_P (bidir), B66_L18_N (bidir), B66_L18_P (bidir), B66_L19_N (bidir), B66_L19_P (bidir), B66_L20_N (bidir), B66_L20_P (bidir), B66_L21_N (bidir), B66_L21_P (bidir), B66_L22_N (bidir), B66_L22_P (bidir), B66_L23_N (out), B66_L23_P (in), B66_L24_N (bidir), B66_L24_P (bidir), B66_T0 (bidir), B66_T1 (bidir), B66_T2 (bidir), B66_T3 (bidir), B228 (harness MGT4), B229_3A (harness MGT3), B229_FP (harness GTH), B230 (harness MGT4)

### Harnesses
MGT3: L0, L1, L2
MGT4: L0, L1, L2, L3

### Nets
3V3_MOD: J1.151 J1.153 J1.155 J1.157 J1.159
GND: J1.1 J1.6 J1.7 J1.12 J1.13 J1.18 J1.19 J1.24 J1.25 J1.30 J1.31 J1.36 J1.37 J1.42 J1.43 J1.48 J1.49 J1.54 J1.55 J1.60 J1.61 J1.66 J1.67 J1.72 J1.73 J1.78 J1.79 J1.84 J1.85 J1.96 J1.97 J1.102 J1.103 J1.109 J1.114 J1.115 J1.126 J1.127 J1.132 J1.133 J1.138 J1.139 J1.144 J1.149 J1.150 J1.152 J1.154 J1.156 J1.158 J1.160
VCCO_66: J1.90 J1.120
B66_L23_N: J1.110 ; port B66_L23_N
B66_L23_P: J1.112 ; port B66_L23_P
B228L0.RX_N: J1.71
B228L0.RX_P: J1.69
B228L0.TX_N: J1.70
B228L0.TX_P: J1.68
B228L1.RX_N: J1.65
B228L1.RX_P: J1.63
B228L1.TX_N: J1.64
B228L1.TX_P: J1.62
B228L2.RX_N: J1.59
B228L2.RX_P: J1.57
B228L2.TX_N: J1.58
B228L2.TX_P: J1.56
B228L3.RX_N: J1.53
B228L3.RX_P: J1.51
B228L3.TX_N: J1.52
B228L3.TX_P: J1.50
B229L0.RX_N: J1.47
B229L0.RX_P: J1.45
B229L0.TX_N: J1.46
B229L0.TX_P: J1.44
B229L1.RX_N: J1.41
B229L1.RX_P: J1.39
B229L1.TX_N: J1.40
B229L1.TX_P: J1.38
B229L2.RX_N: J1.35
B229L2.RX_P: J1.33
B229L2.TX_N: J1.34
B229L2.TX_P: J1.32
B229L3.RX_N: J1.29
B229L3.RX_P: J1.27
B229L3.TX_N: J1.28
B229L3.TX_P: J1.26
B230L0.RX_N: J1.23
B230L0.RX_P: J1.21
B230L0.TX_N: J1.22
B230L0.TX_P: J1.20
B230L1.RX_N: J1.17
B230L1.RX_P: J1.15
B230L1.TX_N: J1.16
B230L1.TX_P: J1.14
B230L2.RX_N: J1.11
B230L2.RX_P: J1.9
B230L2.TX_N: J1.10
B230L2.TX_P: J1.8
B230L3.RX_N: J1.5
B230L3.RX_P: J1.3
B230L3.TX_N: J1.4
B230L3.TX_P: J1.2
DIG_00_Ch2: J1.130 ; port B66_L8_N
DIG_00_Ch3: J1.80 ; port B66_L24_N
DIG_01_Ch2: J1.131 ; port B66_L18_N
DIG_01_Ch3: J1.81 ; port B66_L5_P
DIG_02_Ch2: J1.134 ; port B66_L15_P
DIG_02_Ch3: J1.82 ; port B66_L24_P
DIG_03_Ch2: J1.135 ; port B66_L10_N
DIG_03_Ch3: J1.83 ; port B66_L5_N
DIG_04_Ch2: J1.136 ; port B66_L15_N
DIG_04_Ch3: J1.86 ; port B66_L13_P
DIG_05_Ch2: J1.137 ; port B66_L10_P
DIG_05_Ch3: J1.87 ; port B66_L4_N
DIG_06_Ch2: J1.140 ; port B66_L1_N
DIG_06_Ch3: J1.88 ; port B66_L13_N
DIG_06_Ch5: J1.119 ; port B66_L22_P
DIG_07_Ch2: J1.141 ; port B66_T3
DIG_07_Ch3: J1.89 ; port B66_L4_P
DIG_07_Ch5: J1.117 ; port B66_L22_N
DIG_08_Ch2: J1.142 ; port B66_L1_P
DIG_08_Ch3: J1.92 ; port B66_L11_N
DIG_09_Ch2: J1.143 ; port B66_T2
DIG_09_Ch3: J1.93 ; port B66_L3_N
DIG_10_Ch2: J1.145 ; port B66_T1
DIG_10_Ch3: J1.94 ; port B66_L11_P
DIG_11_Ch2: J1.146 ; port B66_L14_N
DIG_11_Ch3: J1.95 ; port B66_L3_P
DIG_12_Ch2: J1.147 ; port B66_T0
DIG_12_Ch3: J1.98 ; port B66_L7_P
DIG_13_Ch2: J1.148 ; port B66_L14_P
DIG_13_Ch3: J1.99 ; port B66_L2_N
DIG_14_Ch3: J1.100 ; port B66_L7_N
DIG_15_Ch3: J1.101 ; port B66_L2_P
DIG_16_Ch3: J1.104 ; port B66_L21_N
DIG_17_Ch3: J1.105 ; port B66_L17_P
DIG_18_Ch3: J1.106 ; port B66_L21_P
DIG_19_Ch3: J1.107 ; port B66_L17_N
DIG_20_Ch3: J1.111 ; port B66_L20_N
DIG_21_Ch3: J1.113 ; port B66_L20_P
DIG_22_Ch3: J1.116 ; port B66_L12_N
DIG_23_Ch3: J1.118 ; port B66_L12_P
DIG_24_Ch2: J1.122 ; port B66_L16_N
DIG_25_Ch2: J1.123 ; port B66_L19_N
DIG_26_Ch2: J1.124 ; port B66_L16_P
DIG_26_Ch3: J1.74 ; port B66_L9_P
DIG_27_Ch2: J1.125 ; port B66_L19_P
DIG_27_Ch3: J1.75 ; port B66_L6_P
DIG_28_Ch2: J1.128 ; port B66_L8_P
DIG_28_Ch3: J1.76 ; port B66_L9_N
DIG_29_Ch2: J1.129 ; port B66_L18_P
DIG_29_Ch3: J1.77 ; port B66_L6_N
NetJ1_108: J1.108 TP75.1

Not connected (* = marked no-connect by the designer): J1 91* 121*

### Buses and harness runs
harness B229L3 = port B229_FP

### Layout directives
differential pair: B228L0.RX_N, B228L0.RX_P, B228L0.TX_N, B228L0.TX_P, B228L1.RX_N, B228L1.RX_P, B228L1.TX_N, B228L1.TX_P, B228L2.RX_N, B228L2.RX_P, B228L2.TX_N, B228L2.TX_P, B228L3.RX_N, B228L3.RX_P, B228L3.TX_N, B228L3.TX_P, B229L0.RX_N, B229L0.RX_P, B229L0.TX_N, B229L0.TX_P, B229L1.RX_N, B229L1.RX_P, B229L1.TX_N, B229L1.TX_P, B229L2.RX_N, B229L2.RX_P, B229L2.TX_N, B229L2.TX_P, B229L3.RX_N, B229L3.RX_P, B229L3.TX_N, B229L3.TX_P, B230L0.RX_N, B230L0.RX_P, B230L0.TX_N, B230L0.TX_P, B230L1.RX_N, B230L1.RX_P, B230L1.TX_N, B230L1.TX_P, B230L2.RX_N, B230L2.RX_P, B230L2.TX_N, B230L2.TX_P, B230L3.RX_N, B230L3.RX_P, B230L3.TX_N, B230L3.TX_P
net class HS: B228L0.RX_N, B228L0.RX_P, B228L0.TX_N, B228L0.TX_P, B228L1.RX_N, B228L1.RX_P, B228L1.TX_N, B228L1.TX_P, B228L2.RX_N, B228L2.RX_P, B228L2.TX_N, B228L2.TX_P, B228L3.RX_N, B228L3.RX_P, B228L3.TX_N, B228L3.TX_P, B229L0.RX_N, B229L0.RX_P, B229L0.TX_N, B229L0.TX_P, B229L1.RX_N, B229L1.RX_P, B229L1.TX_N, B229L1.TX_P, B229L2.RX_N, B229L2.RX_P, B229L2.TX_N, B229L2.TX_P, B229L3.RX_N, B229L3.RX_P, B229L3.TX_N, B229L3.TX_P, B230L0.RX_N, B230L0.RX_P, B230L0.TX_N, B230L0.TX_P, B230L1.RX_N, B230L1.RX_P, B230L1.TX_N, B230L1.TX_P, B230L2.RX_N, B230L2.RX_P, B230L2.TX_N, B230L2.TX_P, B230L3.RX_N, B230L3.RX_P, B230L3.TX_N, B230L3.TX_P

### Notes on the sheet
- B230_TX3_P
- B230_TX3_N
- GND
- B230_TX2_P
- B230_TX2_N
- B230_TX1_P
- B230_TX1_N
- B230_TX0_P
- B230_TX0_N
- B229_TX3_P
- B229_TX3_N
- B229_TX2_P
- B229_TX2_N
- B229_TX1_P
- B229_TX1_N
- B229_TX0_P
- B229_TX0_N
- B228_TX3_P
- B228_TX3_N
- B228_TX2_P
- B228_TX2_N
- B228_TX1_P
- B228_TX1_N
- B228_TX0_P
- B228_TX0_N
- B66_L9_P
- B66_L9_N
- B66_L24_N
- B66_L24_P
- B66_L13_P
- B66_L13_N
- VCCO_66
- B66_L11_N
- B66_L11_P
- B66_L7_P
- B66_L7_N
- (near TP75) B66_L21_N
- (near TP75) B66_L21_P
- (near TP75) B66_L23_N
- (near TP75) B66_L23_P
- (near TP75) GND
- B66_L12_N
- B66_L12_P
- B66_L16_N
- B66_L16_P
- B66_L8_P
- B66_L8_N
- B66_L15_P
- B66_L15_N
- B66_L1_N
- B66_L1_P
- B66_L14_N
- B66_L14_P
- (near TP75) VREF_66
- Out
- B230_RX3_P
- B230_RX3_N
- B230_RX2_P
- B230_RX2_N
- B230_RX1_P
- B230_RX1_N
- B230_RX0_P
- B230_RX0_N
- B229_RX3_P
- B229_RX3_N
- B229_RX2_P
- B229_RX2_N
- B229_RX1_P
- B229_RX1_N
- B229_RX0_P
- B229_RX0_N
- B228_RX3_P
- B228_RX3_N
- B228_RX2_P
- B228_RX2_N
- B228_RX1_P
- B228_RX1_N
- B228_RX0_P
- B228_RX0_N
- B66_L6_P
- B66_L6_N
- B66_L5_P
- B66_L5_N
- B66_L4_N
- B66_L4_P
- PL_1V8
- B66_L3_N
- B66_L3_P
- B66_L2_N
- B66_L2_P
- B66_L17_P
- B66_L17_N
- B66_L20_N
- B66_L20_P
- B66_L22_N
- B66_L22_P
- B66_L19_N
- B66_L19_P
- B66_L18_P
- B66_L18_N
- B66_L10_N
- B66_L10_P
- B66_T3
- B66_T2
- B66_T1
- B66_T0
- PL_DCIN
- 3x 4 GTH lanes
- 1V8 from Trenz U19 -> Not used
- Title
- Revision:
- Design Engineer:
- Date:
- Project:
- Sheet
- of

### Library data of the parts
J1 = SS5-80-3.50-L-D-K-TR: 0.5 mm Ultra Fine Pitch Socket REF192552-01, 160 Pins; Manufacturer: SAMTEC; Created from: MGremer; Number of positions: 80; Manufacturer Part Number: SS5-80-3.50-L-D-K-TR; PartID: 27; Created On: 01/12/2020 18:14:32; ComponentLink1Description: Homepage; ComponentLink1URL: https://www.samtec.com/de/products/ss5-80-3.50-l-d-k-tr; Component Type: Samtec Connector; Device Package: Connector; Last Updated: 11/07/2024 09:43:54; Mounting Type: SMD; Supplier 1: SAMTEC; Supplier Part Number 1: SS5-80-3.50-L-D-K-TR; Type: Connector; Live Cycle Status: 1; Number of rows: 2; Stock number: not stored; LCSC Part Number: C5292077
TP75 = 25063: AN: 25063; Mixed: SMT